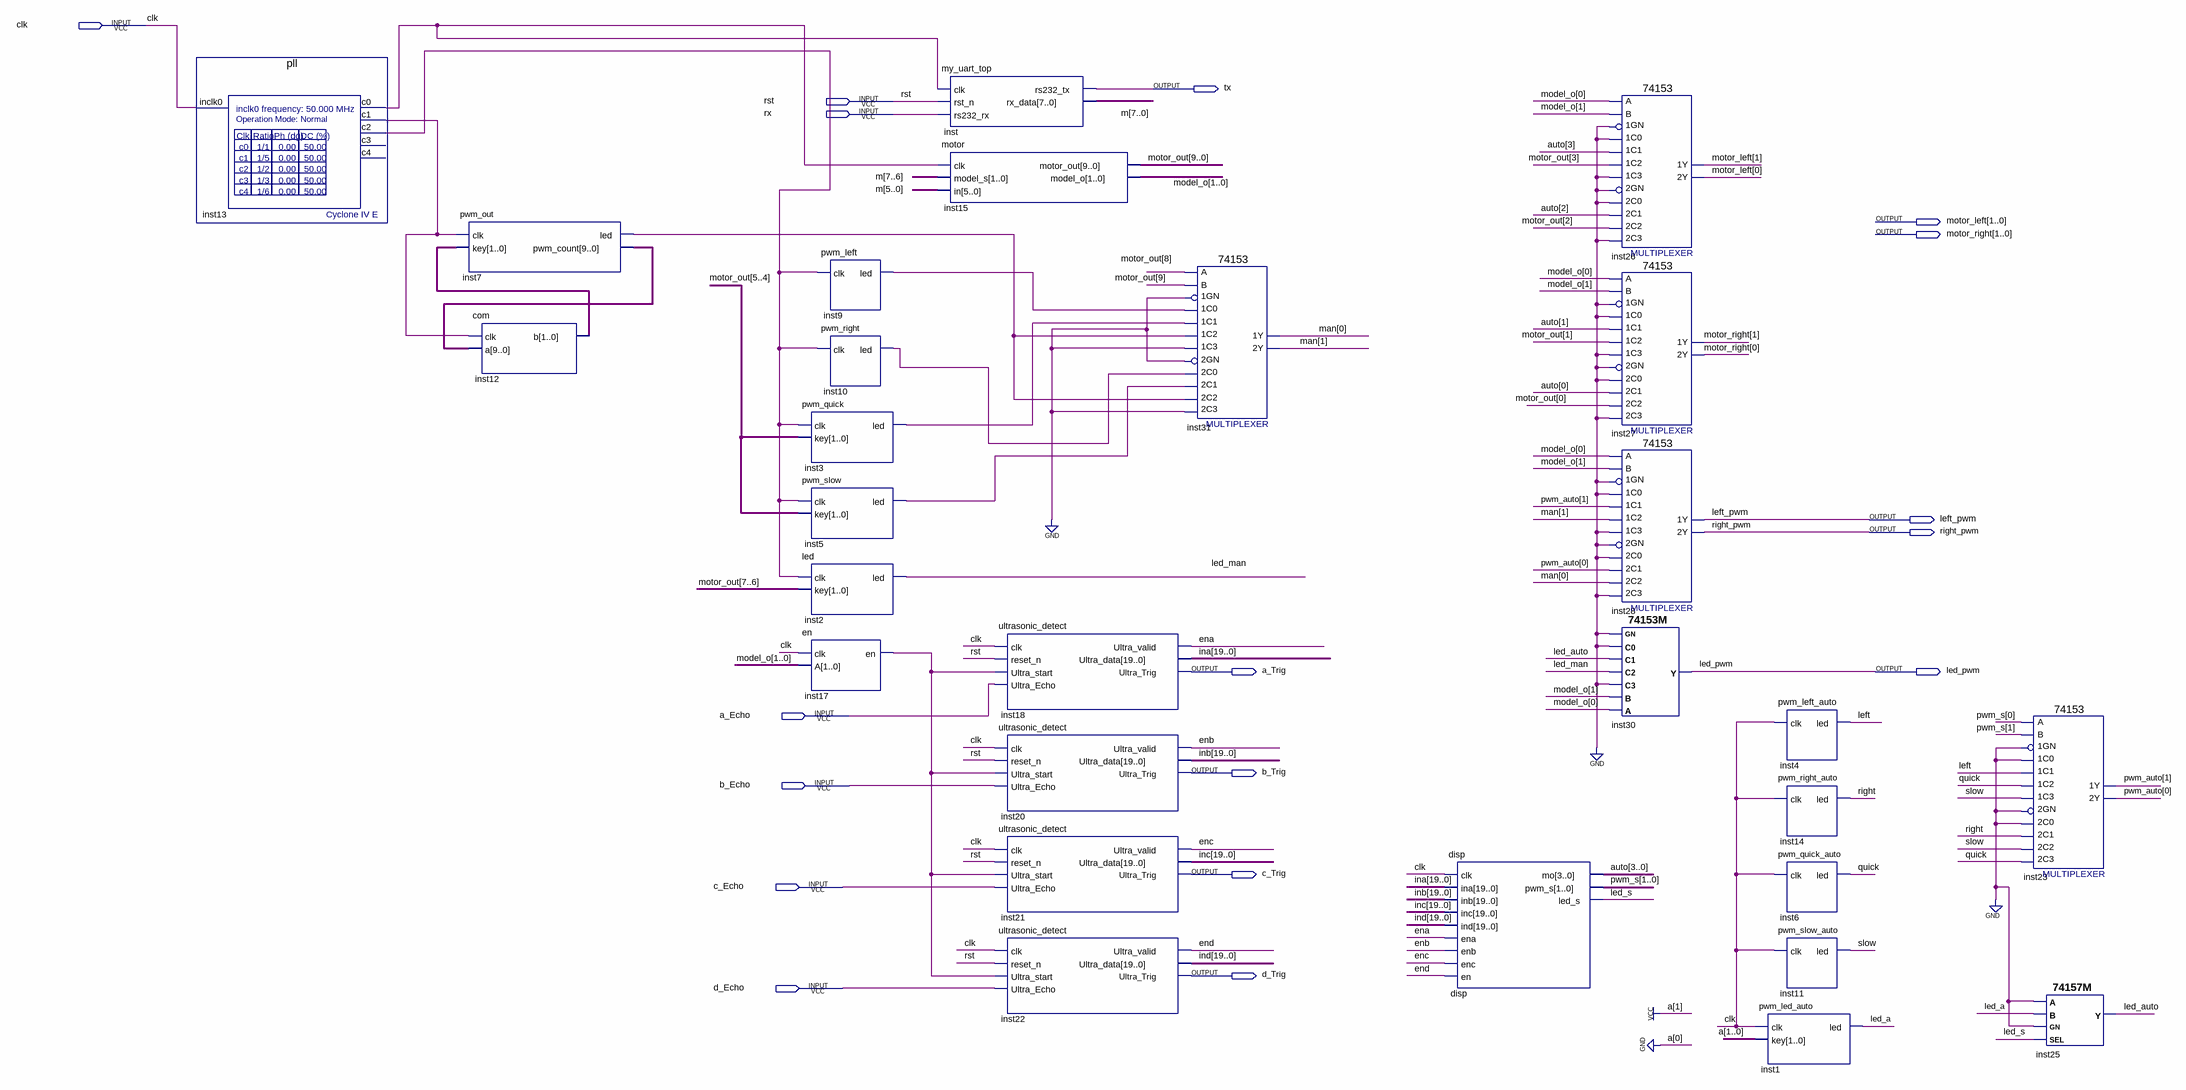
[diagram p0: schematic sheet]
// Quartus schematic top.bdf as structural Verilog: 28 symbols, 17 pins
module top (
  input  clk,
  input  rst,
  input  rx,
  input  a_Echo,
  input  b_Echo,
  input  c_Echo,
  input  d_Echo,
  output tx,
  output [1:0] motor_left,
  output [1:0] motor_right,
  output left_pwm,
  output right_pwm,
  output a_Trig,
  output led_pwm,
  output b_Trig,
  output c_Trig,
  output d_Trig
);

  wire ena, enb, enc, \end , inst3_led, inst5_led, inst7_led, inst9_led, inst10_led, inst13_c0, inst13_c1,
       inst13_c2, inst17_en, led_a, led_auto, led_man, led_s, left, quick, right, slow;
  wire [1:0] inst12_b, man, model_o, pwm_auto, pwm_s;
  wire [3:0] auto;
  wire [7:0] m;
  wire [9:0] inst7_pwm_count, motor_out;
  wire [19:0] ina, inb, inc, ind;

  pll inst13 (.inclk0(clk), .c0(inst13_c0), .c1(inst13_c1), .c2(inst13_c2));  // open: c3, c4
  pwm_out inst7 (.clk(inst13_c1), .key(inst12_b), .led(inst7_led), .pwm_count(inst7_pwm_count));
  com inst12 (.clk(inst13_c1), .a(inst7_pwm_count), .b(inst12_b));
  pwm_quick inst3 (.clk(inst13_c2), .key(motor_out[5:4]), .led(inst3_led));
  pwm_slow inst5 (.clk(inst13_c2), .key(motor_out[5:4]), .led(inst5_led));
  led inst2 (.clk(inst13_c2), .key(motor_out[7:6]), .led(led_man));
  en inst17 (.clk(clk), .A(model_o), .en(inst17_en));
  pwm_left inst9 (.clk(inst13_c2), .led(inst9_led));
  pwm_right inst10 (.clk(inst13_c2), .led(inst10_led));
  my_uart_top inst (.clk(inst13_c0), .rst_n(rst), .rs232_rx(rx), .rs232_tx(tx), .rx_data(m));
  motor inst15 (.clk(inst13_c0), .model_s(m[7:6]), .in(m[5:0]), .motor_out(motor_out), .model_o(model_o));
  ultrasonic_detect inst18 (
    .clk(clk), .reset_n(rst), .Ultra_start(inst17_en), .Ultra_Echo(a_Echo), .Ultra_valid(ena),
    .Ultra_data(ina), .Ultra_Trig(a_Trig));
  ultrasonic_detect inst20 (
    .clk(clk), .reset_n(rst), .Ultra_start(inst17_en), .Ultra_Echo(b_Echo), .Ultra_valid(enb),
    .Ultra_data(inb), .Ultra_Trig(b_Trig));
  ultrasonic_detect inst21 (
    .clk(clk), .reset_n(rst), .Ultra_start(inst17_en), .Ultra_Echo(c_Echo), .Ultra_valid(enc),
    .Ultra_data(inc), .Ultra_Trig(c_Trig));
  ultrasonic_detect inst22 (
    .clk(clk), .reset_n(rst), .Ultra_start(inst17_en), .Ultra_Echo(d_Echo), .Ultra_valid(\end ),
    .Ultra_data(ind), .Ultra_Trig(d_Trig));
  \74153  inst31 (
    .\1C1 (inst3_led), .\1GN (1'b0), .\1C0 (inst9_led), .\2C0 (inst10_led), .\2GN (1'b0), .\2C2 (inst7_led),
    .\1C2 (inst7_led), .\1C3 (1'b0), .B(motor_out[9]), .A(motor_out[8]), .\2C1 (inst5_led), .\2C3 (1'b0),
    .\1Y (man[0]), .\2Y (man[1]));
  disp disp (
    .clk(clk), .ina(ina), .inb(inb), .inc(inc), .ind(ind), .ena(ena), .enb(enb), .enc(enc), .en(\end ),
    .mo(auto), .pwm_s(pwm_s), .led_s(led_s));
  \74153  inst26 (
    .\1C1 (auto[3]), .\1GN (1'b0), .\1C0 (1'b0), .\2C0 (1'b0), .\2GN (1'b0), .\2C2 (motor_out[2]),
    .\1C2 (motor_out[3]), .\1C3 (1'b0), .B(model_o[1]), .A(model_o[0]), .\2C1 (auto[2]), .\2C3 (1'b0),
    .\1Y (motor_left[1]), .\2Y (motor_left[0]));
  \74153  inst27 (
    .\1C1 (auto[1]), .\1GN (1'b0), .\1C0 (1'b0), .\2C0 (1'b0), .\2GN (1'b0), .\2C2 (motor_out[0]),
    .\1C2 (motor_out[1]), .\1C3 (1'b0), .B(model_o[1]), .A(model_o[0]), .\2C1 (auto[0]), .\2C3 (1'b0),
    .\1Y (motor_right[1]), .\2Y (motor_right[0]));
  \74153  inst28 (
    .\1C1 (pwm_auto[1]), .\1GN (1'b0), .\1C0 (1'b0), .\2C0 (1'b0), .\2GN (1'b0), .\2C2 (man[0]),
    .\1C2 (man[1]), .\1C3 (1'b0), .B(model_o[1]), .A(model_o[0]), .\2C1 (pwm_auto[0]), .\2C3 (1'b0),
    .\1Y (left_pwm), .\2Y (right_pwm));
  \74153M  inst30 (
    .A(model_o[0]), .B(model_o[1]), .C3(1'b0), .C2(led_man), .C1(led_auto), .C0(1'b0), .GN(1'b0), .Y(led_pwm));
  pwm_led_auto inst1 (.clk(clk), .key(2'b10), .led(led_a));
  pwm_left_auto inst4 (.clk(clk), .led(left));
  pwm_right_auto inst14 (.clk(clk), .led(right));
  pwm_quick_auto inst6 (.clk(clk), .led(quick));
  pwm_slow_auto inst11 (.clk(clk), .led(slow));
  \74153  inst23 (
    .\1C1 (left), .\1GN (1'b0), .\1C0 (1'b0), .\2C0 (1'b0), .\2GN (1'b0), .\2C2 (slow), .\1C2 (quick),
    .\1C3 (slow), .B(pwm_s[1]), .A(pwm_s[0]), .\2C1 (right), .\2C3 (quick), .\1Y (pwm_auto[1]),
    .\2Y (pwm_auto[0]));
  \74157M  inst25 (.SEL(led_s), .GN(1'b0), .B(led_a), .A(1'b0), .Y(led_auto));
endmodule
